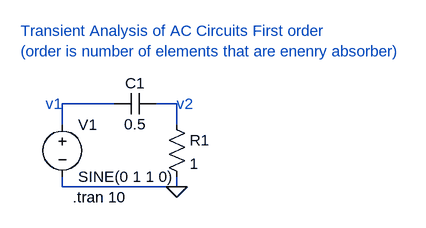
[diagram p0: schematic Lab5_ques1.asc]
Lab5_ques1.asc, the LTspice schematic file:
Version 4
SHEET 1 1092 680
WIRE 176 192 96 192
WIRE 272 192 240 192
WIRE 96 224 96 192
WIRE 272 224 272 192
WIRE 96 320 96 304
WIRE 272 320 272 304
WIRE 272 320 96 320
FLAG 272 320 0
SYMBOL Res 256 208 R0
SYMATTR InstName R1
SYMATTR Value 1
SYMBOL Cap 240 176 R90
WINDOW 0 0 32 VBottom 2
WINDOW 3 32 32 VTop 2
SYMATTR InstName C1
SYMATTR Value 0.5
SYMBOL Voltage 96 208 R0
SYMATTR InstName V1
SYMATTR Value SINE(0 1 1 0)
TEXT 32 80 Left 2 ;Transient Analysis of AC Circuits First order\n(order is number of elements that are enenry absorber)
TEXT 112 336 Left 2 !.tran 10
TEXT 272 192 Left 2 ;v2
TEXT 96 192 Right 2 ;v1

The netlist it stands for:
* Lab5_ques1.asc
R1 N002 0 1
C1 N002 N001 0.5
V1 N001 0 SINE(0 1 1 0)
* Transient Analysis of AC Circuits First order
* (order is number of elements that are enenry absorber)
.tran 10
* v2
* v1
.backanno
.end